# Altium schematic sheet 3_ports.SchDoc: Ports
size A4; OrganizationName: Pluton UPV; Address1: Universitat Politècnica; Address2: de València (UPV); Address3: Camí de Vera, València; Address4: Spain; SheetNumber: 4; SheetTotal: 12
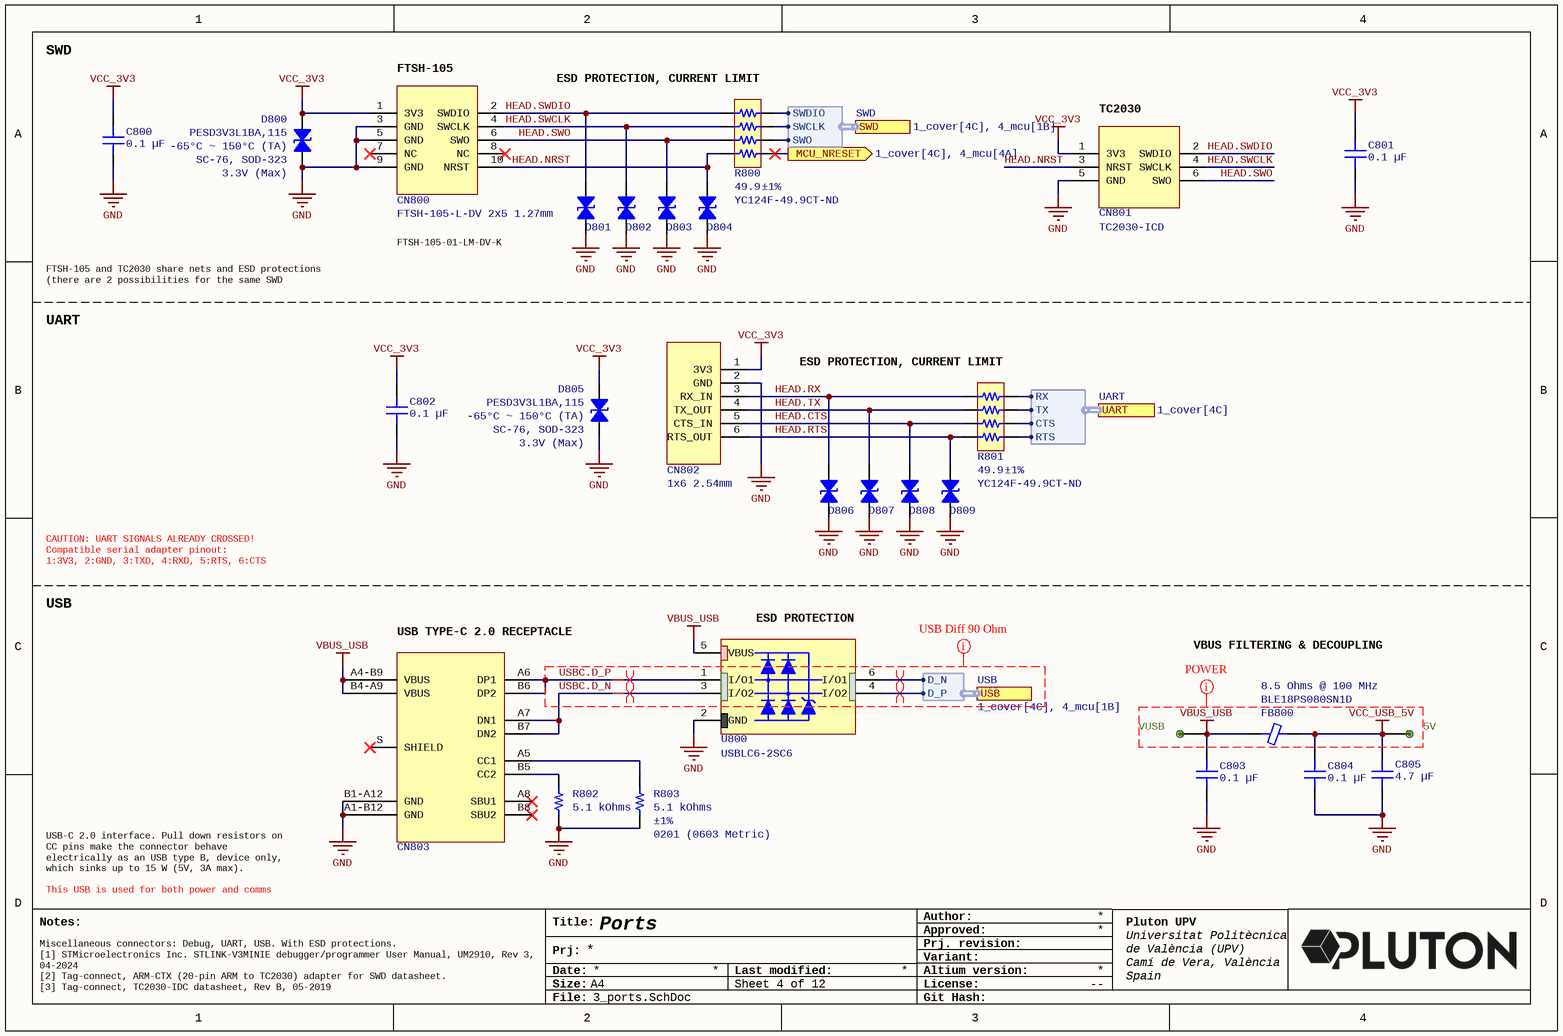
[diagram p0: 3_ports.SchDoc]

## Parts
5V  (no value)  [testpoint_via]  (no BOM)
C800  0.1 µF  [CAP 0402_1005]
C801  0.1 µF  [CAP 0402_1005]
C802  0.1 µF  [CAP 0402_1005]
C803  0.1 µF  [CAP 0402_1005]
C804  0.1 µF  [CAP 0402_1005]
C805  4.7 µF  [CAP 0603_1608]
CN800  FTSH-105-L-DV 2x5 1.27mm  [Samtec ftsh-105-l-dv]
CN801  TC2030-ICD  [TC2030-MCP-NL]  (no BOM)
CN802  1x6 2.54mm  [Header 1x6 2.54mm]  (no BOM)
CN803  USB4105-GF-A  [USB4105-GF-A]  (value not drawn)
D800  Operating Temperature: -65°C ~ 150°C (TA)  Package / Case: SC-76, SOD-323  Voltage - Reverse Standoff (Typ): 3.3V (Max)  [SOD323]  (hidden comment: PESD3V3L1BA,115)
D801  PESD3V3L1BA,115  [SOD323]  (value not drawn)
D802  PESD3V3L1BA,115  [SOD323]  (value not drawn)
D803  PESD3V3L1BA,115  [SOD323]  (value not drawn)
D804  PESD3V3L1BA,115  [SOD323]  (value not drawn)
D805  Operating Temperature: -65°C ~ 150°C (TA)  Package / Case: SC-76, SOD-323  Voltage - Reverse Standoff (Typ): 3.3V (Max)  [SOD323]  (hidden comment: PESD3V3L1BA,115)
D806  PESD3V3L1BA,115  [SOD323]  (value not drawn)
D807  PESD3V3L1BA,115  [SOD323]  (value not drawn)
D808  PESD3V3L1BA,115  [SOD323]  (value not drawn)
D809  PESD3V3L1BA,115  [SOD323]  (value not drawn)
FB800  Part Number: BLE18PS080SN1D  [FER 0603_1608]  (hidden comment: 8.5 Ohms @ 100 MHz)
R800  Resistance (Ohms): 49.9  Supplier Part Number 1: YC124F-49.9CT-ND  Tolerance: ±1%  [RESNET 0804-8 CONVEX]  (hidden comment: YC124-FR-0749R9L)
R801  Resistance (Ohms): 49.9  Supplier Part Number 1: YC124F-49.9CT-ND  Tolerance: ±1%  [RESNET 0804-8 CONVEX]  (hidden comment: YC124-FR-0749R9L)
R802  5.1 kOhms  [RES 0201_0603]
R803  Device Package: 0201 (0603 Metric)  Tolerance: ±1%  [RES 0201_0603]  (hidden comment: 5.1 kOhms)
U800  USBLC6-2SC6  [SOT23-6L]
VUSB  (no value)  [testpoint_via]  (no BOM)

## Ports
MCU_NRESET (out, see 1_cover[4C], 4_mcu[4A]), SWD (harness SWD, see 1_cover[4C], 4_mcu[1B]), UART (harness UART, see 1_cover[4C]), USB (harness USB, see 1_cover[4C], 4_mcu[1B])

## Harnesses
SWD: SWDIO, SWCLK, SWO
UART: TX, CTS, RTS, RX
USB: D_N, D_P

## Nets
GND: C800.1 C801.1 C802.1 C803.1 C804.1 C805.1 CN800.3(GND) CN800.5(GND) CN800.9(GND) CN801.5(GND) CN802.2(GND) CN803.A1-B12(GND) CN803.B1-A12(GND) D800.1 D801.1 D802.1 D803.1 D804.1 D805.1 D806.1 D807.1 D808.1 D809.1 R802.1 R803.1 U800.2(GND)
VBUS_USB: C803.2 CN803.A4-B9(VBUS) CN803.B4-A9(VBUS) FB800.1 U800.5(VBUS) VUSB.0
VCC_3V3: C800.2 C801.2 C802.2 CN800.1(3V3) CN801.1(3V3) CN802.1(3V3) D800.2 D805.2
VCC_USB_5V: 5V.0 C804.2 C805.2 FB800.2
HEAD.CTS: CN802.5(CTS_IN) D808.2 R801.3
HEAD.NRST: CN800.10(NRST) CN801.3(NRST) D804.2 R800.4
HEAD.RTS: CN802.6(RTS_OUT) D809.2 R801.4
HEAD.RX: CN802.3(RX_IN) D806.2 R801.1
HEAD.SWCLK: CN800.4(SWCLK) CN801.4(SWCLK) D802.2 R800.2
HEAD.SWDIO: CN800.2(SWDIO) CN801.2(SWDIO) D801.2 R800.1
HEAD.SWO: CN800.6(SWO) CN801.6(SWO) D803.2 R800.3
HEAD.TX: CN802.4(TX_OUT) D807.2 R801.2
MCU_NRESET: R800.5 ; port MCU_NRESET
USBC.D_N: CN803.A7(DN1) CN803.B7(DN2) U800.3(I/O2)
USBC.D_P: CN803.A6(DP1) CN803.B6(DP2) U800.1(I/O1)
NetCN803_A5: CN803.A5(CC1) R803.2
NetCN803_B5: CN803.B5(CC2) R802.2
NetR800_6: R800.6 ; port SWD.SWO
NetR800_7: R800.7 ; port SWD.SWCLK
NetR800_8: R800.8 ; port SWD.SWDIO
NetR801_5: R801.5 ; port UART.RTS
NetR801_6: R801.6 ; port UART.CTS
NetR801_7: R801.7 ; port UART.TX
NetR801_8: R801.8 ; port UART.RX
NetU800_4: U800.4(I/O2) ; port USB.D_P
NetU800_6: U800.6(I/O1) ; port USB.D_N

Not connected (* = marked no-connect by the designer): CN800 7(NC)* 8(NC)*; CN803 A8(SBU1)* B8(SBU2)* S(SHIELD)*

## Layout directives
differential pair: NetU800_4, NetU800_6, USBC.D_N, USBC.D_P
rule Width Constraint [Pref Width = 0.4mm    Min Width = 0.3mm    Max Width = 0.5mm]; net class POWER: VBUS_USB, VCC_USB_5V
net class USB90; rule Differential Pairs Routing [Pref Gap = 0.127mm    Min Gap  = 0.127mm    Max Gap  = 0.127mmPref Width = 0.269mm    Min Width  = 0.269mm    Max Width  = 0.269mm]: USBC.D_N, USBC.D_P

## Notes on the sheet
- SWD
- (near CN800) FTSH-105
- (near R800) ESD PROTECTION, CURRENT LIMIT
- (near CN801) TC2030
- FTSH-105-01-LM-DV-K
- FTSH-105 and TC2030 share nets and ESD protections (there are 2 possibilities for the same SWD interface!)
- UART
- (near R801) ESD PROTECTION, CURRENT LIMIT
- CAUTION: UART SIGNALS ALREADY CROSSED!
  Compatible serial adapter pinout:
  1:3V3, 2:GND, 3:TXD, 4:RXD, 5:RTS, 6:CTS
- USB
- (near CN803) USB TYPE-C 2.0 RECEPTACLE
- (near U800) ESD PROTECTION
- VBUS FILTERING & DECOUPLING
- USB-C 2.0 interface. Pull down resistors on CC pins make the connector behave electrically as an USB type B, device only, which sinks up to 15 W (5V, 3A max).
- This USB is used for both power and comms
- Miscellaneous connectors: Debug, UART, USB. With ESD protections.
  [1] STMicroelectronics Inc. STLINK-V3MINIE debugger/programmer User Manual, UM2910, Rev 3, 04-2024
  [2] Tag-connect, ARM-CTX (20-pin ARM to TC2030) adapter for SWD datasheet.
  [3] Tag-connect, TC2030-IDC datasheet, Rev B, 05-2019
  [4] STMicroelectronics Inc. AN4879, Rev 6,
- Notes:
- Title:
- Author:
- Approved:
- Date:
- Prj:
- Size:
- A4
- Last modified:
- Altium version:
- Variant:
- Prj. revision:
- License:
- --
- File:
- Git Hash:

## Library data of the parts
5V VUSB = TestPoint-VIA: Test point, thru-hole
C800-C804 = C0402C104K4RECAUTO: CAP CER 0402 0.1UF 16V X7R 10%; manufacturer: KEMET; Part Number: C0402C104K4RECAUTO; Value: 0.1 µF; Applications: Automotive, ESD Protection; Capacitance: 0.1 µF; componentlink1description: Datasheet; componentlink1url: https://api.kemet.com/component-edge/download/datasheet/C0402C104K4RECAUTO.pdf; componentlink2description: DigiKey Link; componentlink2url: https://www.digikey.com/en/products/detail/kemet/C0402C104K4RECAUTO/8563695; Device Package: 0402 (1005 Metric); lastupdated: 09/02/2024 20:04:38; Lifecycle Status: Active; Minimum Order: 1; Mounting Type: Surface Mount, MLCC; Operating Temperature: -55°C ~ 125°C; Package / Case: 0402 (1005 Metric); packaging: TapeAndReel; partid: 1731; Part Status: Active; price: 0.01; Ratings: AEC-Q200; series: ESD SMD Auto X7R; Size / Dimension: 0.039" L x 0.020" W (1.00mm x 0.50mm); Supplier 1: DigiKey; Supplier Part Number 1: 399-17167-1-ND; Temperature Coefficient: X7R; Thickness (Max): 0.022" (0.55mm); Tolerance: ±10%; Voltage - Rated: 16V
C805 = GRM188Z71C475KE21J: CAP CER 4.7UF 16V X7R 0603; manufacturer: Murata Electronics; Tolerance: ±10%; Part Number: GRM188Z71C475KE21J; Value: 4.7 µF; Applications: General Purpose; Capacitance: 4.7 µF; componentlink1description: Datasheet; componentlink1url: https://search.murata.co.jp/Ceramy/image/img/A01X/G101/ENG/GRM188Z71C475KE21-01A.pdf; componentlink2description: DigiKey Link; componentlink2url: https://www.digikey.com/en/products/detail/murata-electronics/GRM188Z71C475KE21J/16033436; Device Package: 0603 (1608 Metric); lastupdated: 09/02/2024 20:09:51; Lifecycle Status: Active; Minimum Order: 1; Mounting Type: Surface Mount, MLCC; Operating Temperature: -55°C ~ 125°C; Package / Case: 0603 (1608 Metric); packaging: TapeAndReel; partid: 41988; Part Status: Active; price: 0.04; series: GRM; Size / Dimension: 0.063" L x 0.031" W (1.60mm x 0.80mm); Supplier 1: DigiKey; Supplier Part Number 1: 490-GRM188Z71C475KE21JCT-ND; Temperature Coefficient: X7R; Thickness (Max): 0.039" (1.00mm); Voltage - Rated: 16V
CN800 = SWD Header 2x5 1.27mm: Samtec FTSH-105-L-DV
CN802 = UART Header 1x6 2.54mm: Header 1x6 2.54mm
CN803 = USB-C USB4105-GF-A: z
D800 D805 = PESD3V3L1BA,115: TVS DIODE 3.3VWM 26VC SOD323; Manufacturer: Nexperia USA Inc.; Bidirectional Channels: 1; Capacitance @ Frequency: 101pF @ 1MHz; Current - Peak Pulse (10/1000µs): 18A (8/20µs); Power Line Protection: No; Power - Peak Pulse: 500W; Type: Zener; Voltage - Breakdown (Min): 5.8V; Voltage - Clamping (Max) @ Ipp: 26V; Part Number: PESD3V3L1BA,115; Applications: General Purpose; ComponentLink1Description: Datasheet; ComponentLink1URL: https://assets.nexperia.com/documents/data-sheet/PESDXL1BA_SER.pdf; ComponentLink2Description: DigiKey Link; ComponentLink2URL: https://www.digikey.com/en/products/detail/nexperia-usa-inc/PESD3V3L1BA-115/1157438; LastUpdated: 03/06/2024 20:22:28; Lifecycle Status: Active; Minimum Order: 1; Mounting Type: Surface Mount; Packaging: TapeAndReel; PartId: 9994; Part Status: Active; Price: 0.06; Series: -; Supplier 1: DigiKey; Supplier Part Number 1: 1727-3825-1-ND; Supplier Device Package: SOD-323
D801-D804 D806-D809 = PESD3V3L1BA,115: TVS DIODE 3.3VWM 26VC SOD323; Manufacturer: Nexperia USA Inc.; Bidirectional Channels: 1; Capacitance @ Frequency: 101pF @ 1MHz; Current - Peak Pulse (10/1000µs): 18A (8/20µs); Power Line Protection: No; Power - Peak Pulse: 500W; Type: Zener; Voltage - Breakdown (Min): 5.8V; Voltage - Clamping (Max) @ Ipp: 26V; Voltage - Reverse Standoff (Typ): 3.3V (Max); Part Number: PESD3V3L1BA,115; Applications: General Purpose; ComponentLink1Description: Datasheet; ComponentLink1URL: https://assets.nexperia.com/documents/data-sheet/PESDXL1BA_SER.pdf; ComponentLink2Description: DigiKey Link; ComponentLink2URL: https://www.digikey.com/en/products/detail/nexperia-usa-inc/PESD3V3L1BA-115/1157438; LastUpdated: 03/06/2024 20:22:28; Lifecycle Status: Active; Minimum Order: 1; Mounting Type: Surface Mount; Operating Temperature: -65°C ~ 150°C (TA); Package / Case: SC-76, SOD-323; Packaging: TapeAndReel; PartId: 9994; Part Status: Active; Price: 0.06; Series: -; Supplier 1: DigiKey; Supplier Part Number 1: 1727-3825-1-ND; Supplier Device Package: SOD-323
FB800 = BLE18PS080SN1D: FERRITE BEAD 8.5 OHM 0603 1LN; Manufacturer: Murata Electronics; Current Rating (Max): 8A; DC Resistance (DCR) (Max): 4mOhm; Filter Type: Power Line; Number of Lines: 1; ComponentLink1Description: Datasheet; ComponentLink1URL: https://www.murata.com/products/productdata/8800169525278/ENFA0080.pdf; ComponentLink2Description: DigiKey Link; ComponentLink2URL: https://www.digikey.com/en/products/detail/murata-electronics/BLE18PS080SN1D/13904803; Device Package: 0603 (1608 Metric); Height (Max): 0.030" (0.75mm); Impedance @ Frequency: 8.5 Ohms @ 100 MHz; LastUpdated: 03/06/2024 19:51:46; Lifecycle Status: Active; Minimum Order: 1; Mounting Type: Surface Mount; Operating Temperature: -55°C ~ 125°C; Package / Case: 0603 (1608 Metric); Packaging: TapeAndReel; PartId: 2651; Part Status: Active; Price: 0.08; Series: EMIFIL®, BLE18; Size / Dimension: 0.063" L x 0.031" W (1.60mm x 0.80mm); Supplier 1: DigiKey; Supplier Part Number 1: 490-BLE18PS080SN1DCT-ND; Value: 8.5 Ohms @ 100 MHz
R800 R801 = YC124-FR-0749R9L: RES ARRAY 4 RES 49.9 OHM 0804; Manufacturer: Yageo; Circuit Type: Isolated; Number of Resistors: 4; Power Per Element: 62.5mW; Temperature Coefficient: ±200ppm/°C; Part Number: YC124-FR-0749R9L; Applications: DDRAM, SDRAM; ComponentLink1Description: Datasheet; ComponentLink1URL: https://www.yageo.com/upload/media/product/productsearch/datasheet/rchip/PYu-YC_TC_group_51_RoHS_L_9.pdf; ComponentLink2Description: DigiKey Link; ComponentLink2URL: https://www.digikey.com/en/products/detail/yageo/YC124-FR-0749R9L/2827647; Height - Seated (Max): 0.022" (0.55mm); LastUpdated: 03/06/2024 20:05:56; Lifecycle Status: Active; Minimum Order: 1; Mounting Type: Surface Mount; Number of Pins: 8; Operating Temperature: -55°C ~ 155°C; Package / Case: 0804, Convex, Long Side Terminals; Packaging: TapeAndReel; PartId: 501; Part Status: Active; Price: 0.03; Series: YC124; Size / Dimension: 0.079" L x 0.039" W (2.00mm x 1.00mm); Supplier 1: DigiKey
R802 R803 = AC0201FR-075K1L: RES SMD 5.1K OHM 1% 1/20W 0201; Manufacturer: Yageo; Power (Watts): 0.05W, 1/20W; Temperature Coefficient: ±200ppm/°C; Part Number: AC0201FR-075K1L; Value: 5.1 kOhms; ComponentLink1Description: Datasheet; ComponentLink1URL: https://www.yageo.com/upload/media/product/productsearch/datasheet/rchip/PYu-AC_51_RoHS_L_7.pdf; ComponentLink2Description: DigiKey Link; ComponentLink2URL: https://www.digikey.com/en/products/detail/yageo/AC0201FR-075K1L/5894738; Composition: Thick Film; Features: Automotive AEC-Q200, Moisture Resistant; Height - Seated (Max): 0.010" (0.26mm); LastUpdated: 04/06/2024 19:12:02; Lifecycle Status: Active; Minimum Order: 1; Number of Terminations: 2; Operating Temperature: -55°C ~ 155°C; Package / Case: 0201 (0603 Metric); Packaging: TapeAndReel; PartId: 225; Part Status: Active; Price: 0.01; Ratings: AEC-Q200; Resistance: 5.1 kOhms; Series: AC; Size / Dimension: 0.024" L x 0.012" W (0.60mm x 0.30mm); Supplier 1: DigiKey; Supplier Part Number 1: YAG5228CT-ND; Supplier Device Package: 0201
  R802: Device Package: 0201 (0603 Metric); Tolerance: ±1%